# EAGLE design Atmega1280_xmem_512K_v2 (EAGLE 7.1.0)
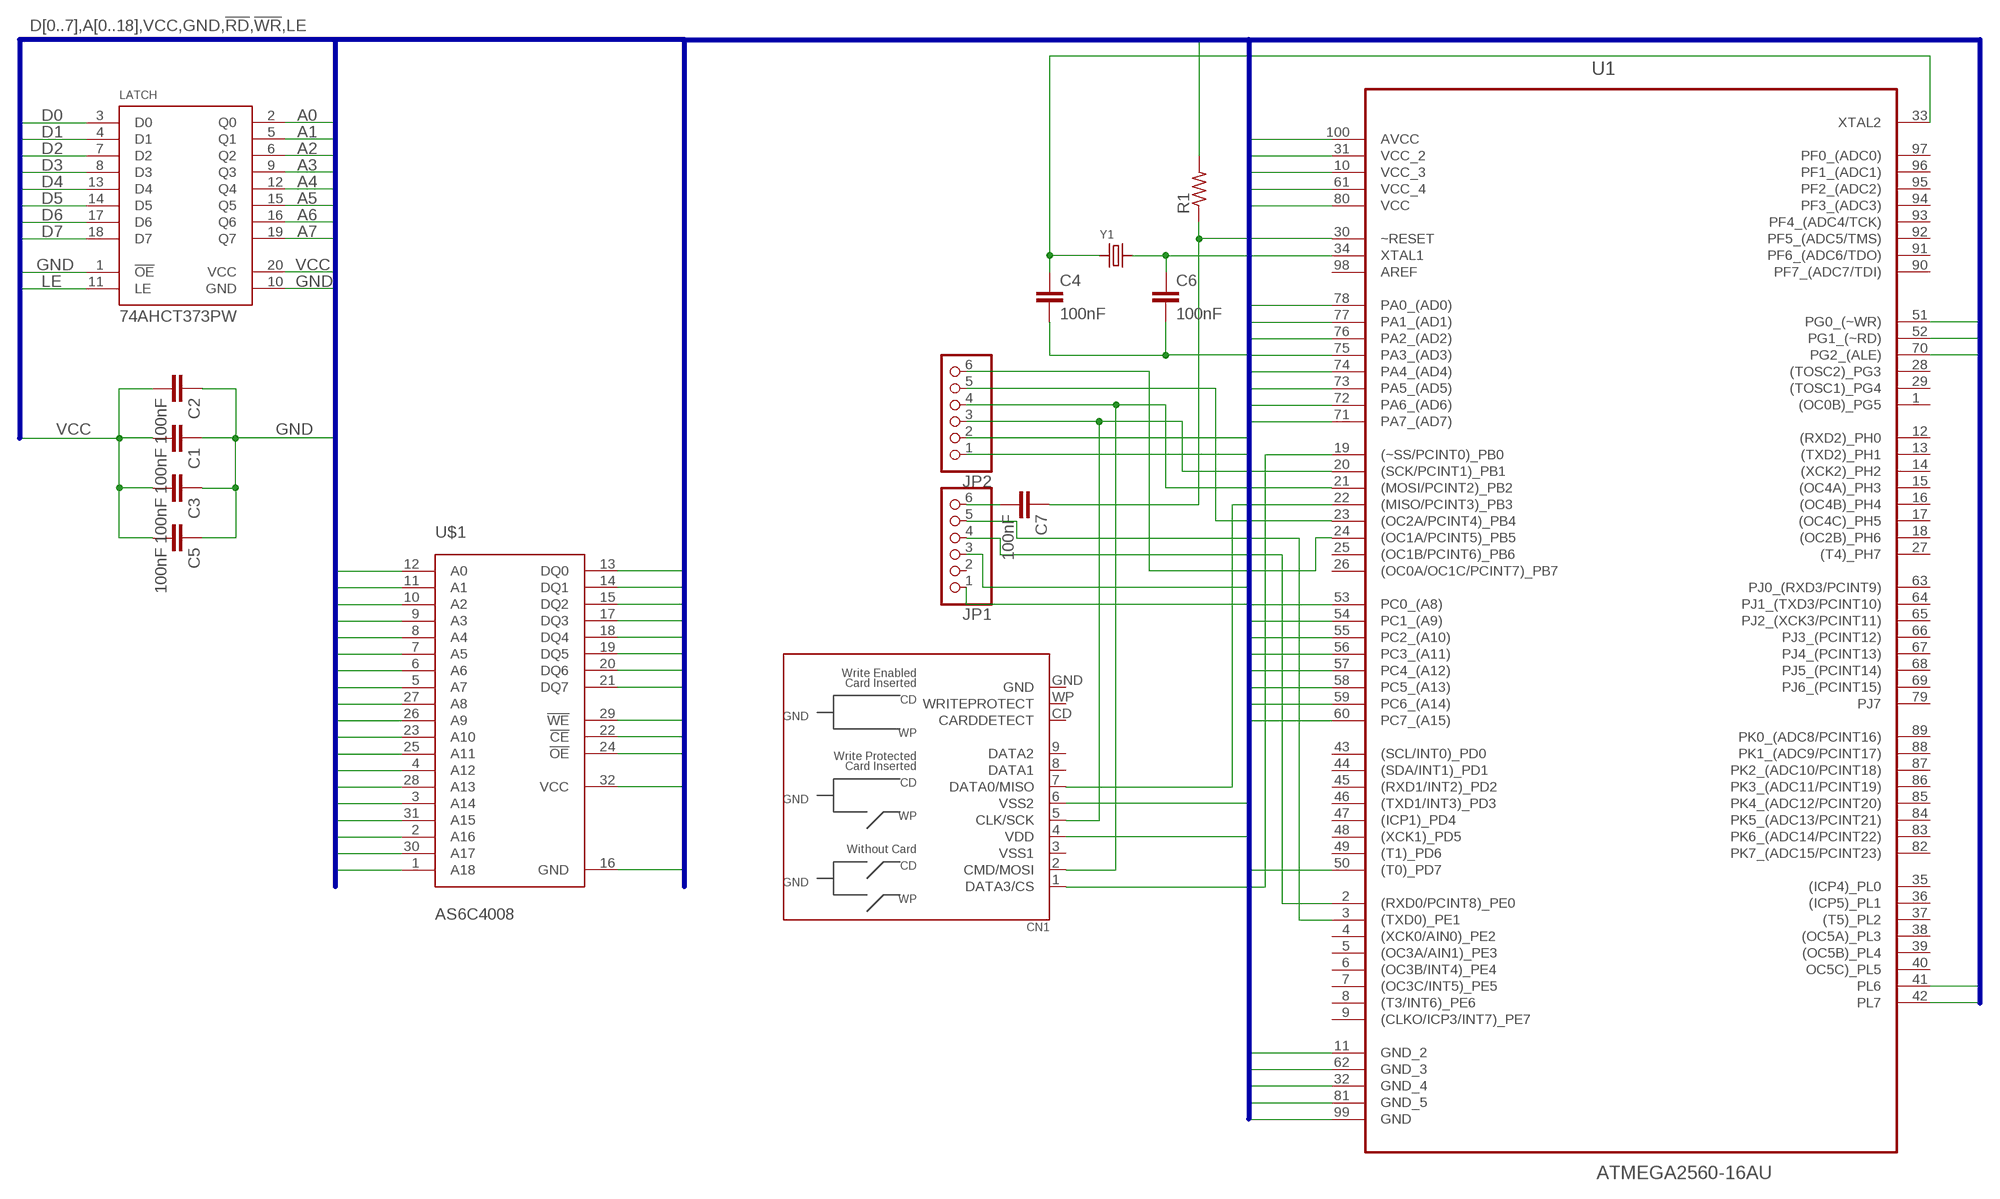
[diagram p0: schematic, sheet 1]

## Parts
C1  100nF  C-EUC0603  [C0603]
C2  100nF  C-EUC0603  [C0603]
C3  100nF  C-EUC0603  [C0603]
C4  100nF  C-EUC0603  [C0603]
C5  100nF  C-EUC0603  [C0603]
C6  100nF  C-EUC0603  [C0603]
C7  100nF  C-EUC0603  [C0603]
CN1  SDCARD  [SDCARD_SMT_4U06132]
JP1  HEADER-1X6  [1X06_OVAL]
JP2  HEADER-1X6  [1X06_OVAL]
LATCH  74AHCT373PW  [TSSOP20]
R1  R-US_R0603  [R0603]
U1  ATMEGA2560-16AU  [QFP50P1600X1600X120-100N]
U$1  AS6C4008  [SOP32]
Y1  CRYSTALSMD  [HC49UP]

## Nets
!RD: U1.52(PG1_(~RD)) U$1.24(!OE)
!WR: U1.51(PG0_(~WR)) U$1.29(!WE)
A0: LATCH.2(Q0) U$1.12(A0)
A1: LATCH.5(Q1) U$1.11(A1)
A2: LATCH.6(Q2) U$1.10(A2)
A3: LATCH.9(Q3) U$1.9(A3)
A4: LATCH.12(Q4) U$1.8(A4)
A5: LATCH.15(Q5) U$1.7(A5)
A6: LATCH.16(Q6) U$1.6(A6)
A7: LATCH.19(Q7) U$1.5(A7)
A8: U1.53(PC0_(A8)) U$1.27(A8)
A9: U1.54(PC1_(A9)) U$1.26(A9)
A10: U1.55(PC2_(A10)) U$1.23(A10)
A11: U1.56(PC3_(A11)) U$1.25(A11)
A12: U1.57(PC4_(A12)) U$1.4(A12)
A13: U1.58(PC5_(A13)) U$1.28(A13)
A14: U1.59(PC6_(A14)) U$1.3(A14)
A15: U1.60(PC7_(A15)) U$1.31(A15)
A16: U1.50((T0)_PD7) U$1.2(A16)
A17: U1.42(PL7) U$1.30(A17)
A18: U1.41(PL6) U$1.1(A18)
D0: LATCH.3(D0) U1.78(PA0_(AD0)) U$1.13(DQ0)
D1: LATCH.4(D1) U1.77(PA1_(AD1)) U$1.14(DQ1)
D2: LATCH.7(D2) U1.76(PA2_(AD2)) U$1.15(DQ2)
D3: LATCH.8(D3) U1.75(PA3_(AD3)) U$1.17(DQ3)
D4: LATCH.13(D4) U1.74(PA4_(AD4)) U$1.18(DQ4)
D5: LATCH.14(D5) U1.73(PA5_(AD5)) U$1.19(DQ5)
D6: LATCH.17(D6) U1.72(PA6_(AD6)) U$1.20(DQ6)
D7: LATCH.18(D7) U1.71(PA7_(AD7)) U$1.21(DQ7)
GND [power]: C1.1 C2.1 C3.1 C4.2 C5.1 C6.2 CN1.6(VSS2) JP1.1 JP2.1 LATCH.1(!OE) LATCH.10(GND) U1.11(GND_2) U1.32(GND_4) U1.62(GND_3) U1.81(GND_5) U1.99(GND) U$1.16(GND) U$1.22(!CE)
LE: LATCH.11(LE) U1.70(PG2_(ALE))
N$2: C6.1 U1.34(XTAL1) Y1.2
N$3: C4.1 U1.33(XTAL2) Y1.1
N$4: C7.1 R1.1 U1.30(~RESET)
N$5: C7.2 JP1.6
N$6: JP1.5 U1.3((TXD0)_PE1)
N$7: JP1.4 U1.2((RXD0/PCINT8)_PE0)
N$8: CN1.5(CLK/SCK) JP2.3 U1.20((SCK/PCINT1)_PB1)
N$9: CN1.2(CMD/MOSI) JP2.4 U1.21((MOSI/PCINT2)_PB2)
N$10: JP2.5 U1.23((OC2A/PCINT4)_PB4)
N$11: JP2.6 U1.24((OC1A/PCINT5)_PB5)
N$12: CN1.7(DATA0/MISO) U1.22((MISO/PCINT3)_PB3)
N$13: CN1.1(DATA3/CS) U1.19((~SS/PCINT0)_PB0)
VCC [power]: C1.2 C2.2 C3.2 C5.2 CN1.4(VDD) JP1.3 JP2.2 LATCH.20(VCC) R1.2 U1.10(VCC_3) U1.31(VCC_2) U1.61(VCC_4) U1.80(VCC) U1.100(AVCC) U$1.32(VCC)
Unconnected: CN1.3(VSS1) CN1.8(DATA1) CN1.9(DATA2) CN1.CD(CARDDETECT) CN1.GND CN1.WP(WRITEPROTECT) JP1.2 U1.1((OC0B)_PG5) U1.4((XCK0/AIN0)_PE2) U1.5((OC3A/AIN1)_PE3) U1.6((OC3B/INT4)_PE4) U1.7((OC3C/INT5)_PE5) U1.8((T3/INT6)_PE6) U1.9((CLKO/ICP3/INT7)_PE7) U1.12((RXD2)_PH0) U1.13((TXD2)_PH1) U1.14((XCK2)_PH2) U1.15((OC4A)_PH3) U1.16((OC4B)_PH4) U1.17((OC4C)_PH5) U1.18((OC2B)_PH6) U1.25((OC1B/PCINT6)_PB6) U1.26((OC0A/OC1C/PCINT7)_PB7) U1.27((T4)_PH7) U1.28((TOSC2)_PG3) U1.29((TOSC1)_PG4) U1.35((ICP4)_PL0) U1.36((ICP5)_PL1) U1.37((T5)_PL2) U1.38((OC5A)_PL3) U1.39((OC5B)_PL4) U1.40(OC5C)_PL5) U1.43((SCL/INT0)_PD0) U1.44((SDA/INT1)_PD1) U1.45((RXD1/INT2)_PD2) U1.46((TXD1/INT3)_PD3) U1.47((ICP1)_PD4) U1.48((XCK1)_PD5) U1.49((T1)_PD6) U1.63(PJ0_(RXD3/PCINT9)) U1.64(PJ1_(TXD3/PCINT10)) U1.65(PJ2_(XCK3/PCINT11)) U1.66(PJ3_(PCINT12)) U1.67(PJ4_(PCINT13)) U1.68(PJ5_(PCINT14)) U1.69(PJ6_(PCINT15)) U1.79(PJ7) U1.82(PK7_(ADC15/PCINT23)) U1.83(PK6_(ADC14/PCINT22)) U1.84(PK5_(ADC13/PCINT21)) U1.85(PK4_(ADC12/PCINT20)) U1.86(PK3_(ADC11/PCINT19)) U1.87(PK2_(ADC10/PCINT18)) U1.88(PK1_(ADC9/PCINT17)) U1.89(PK0_(ADC8/PCINT16)) U1.90(PF7_(ADC7/TDI)) U1.91(PF6_(ADC6/TDO)) U1.92(PF5_(ADC5/TMS)) U1.93(PF4_(ADC4/TCK)) U1.94(PF3_(ADC3)) U1.95(PF2_(ADC2)) U1.96(PF1_(ADC1)) U1.97(PF0_(ADC0)) U1.98(AREF)

## Buses
D[0..7],A[0..18],VCC,GND,!RD,!WR,LE

## Library data of the parts
C1-C7 = resistor:C-EU: CAPACITOR, European symbol
CN1 = microbuilder:SDCARD: SD Card Reader 06132 = Inexpensive SMT 19646 = Push/Pull SMT
JP1 JP2 = OLED_mod:HEADER-1X6: PIN HEADER
LATCH = andy:74AHCT373PW
R1 = resistor:R-US_: RESISTOR, American symbol
U1 = Atmel_By_element14_Batch_1-00:ATMEGA2560-16AU: Microcontroller; DESCRIPTION: Microcontroller; MPN: ATMEGA2560-16AU; OC_FARNELL: 1288330; OC_NEWARK: 23M5051; PACKAGE: LQFP-100; SUPPLIER: ATMEL
U$1 = test:AS6C4008: IC SRAM 4MBIT (512K x 8) 32SOP
Y1 = OLED_mod:CRYSTAL: Crystals HC49UP - Surface Mount Crystal 4.0MHz 18pF +/-30ppm Surface Mount Crystal [Digikey: 535-9857-1-ND] 12.0 MHz Surface Mount Crystal [Digikey: 535-9869-6-ND] 25.0 MHz Surface Mount Crystal [Digikey: 535-9078-1-ND] 2.5 x 2.0mm - MEMs SMT Crystal 16.0 MHz 10pF 20ppm 2.5 x 2.0mm Crystal [Digikey -40-85°C: 535-10923-1-ND] 3.2 x 2.5mm - MEMs SMT Crystal 12.0 MHz 8pF 15ppm 3.2 x 2.5mm Crystal [Digikey: -10-70°C: 644-1047-1-ND -40-125°C: 644-1128-1-ND] 16.0 MHz 8pF 15ppm 3.2 x 2.5mm Crystal [Digikey: -10-70°C: 644-1049-1-ND -40-125°C: 644-1129-2-ND] 16.0 MHz 10pF 10ppm 3.2 x 2.5mm Crystal [Digikey: 644-1100-1-ND] 27.12 MHz 18pF 30ppm 3.2 x 2.5mm Crystal [Digikey: 887-1424-1-ND] 27.12MHz 10pF 10ppm 3.2 x 2.5mm Crystal [Digikey: 887-1329-1-ND] 4.9 x 1.8mm - MEMs SMT Crystal 32.768 KHz 12.5pF 20ppm 4.9 x 1.8mm Crystal [Digikey: SE2415CT-ND] 8.0 x 3.8mm - Surface Mount Crystal 32.768kHz 12.5pF 20ppm -40°C-85°C [Digikey: 535-9166-2-ND] Cylinder 32.768KHz Cylinder Crystal (2x6mm body) [Ex. Digikey: 300-8341-2-ND]

## Net classes
0 default: width 0.254 mm
1 power: width 0.406 mm

## Board
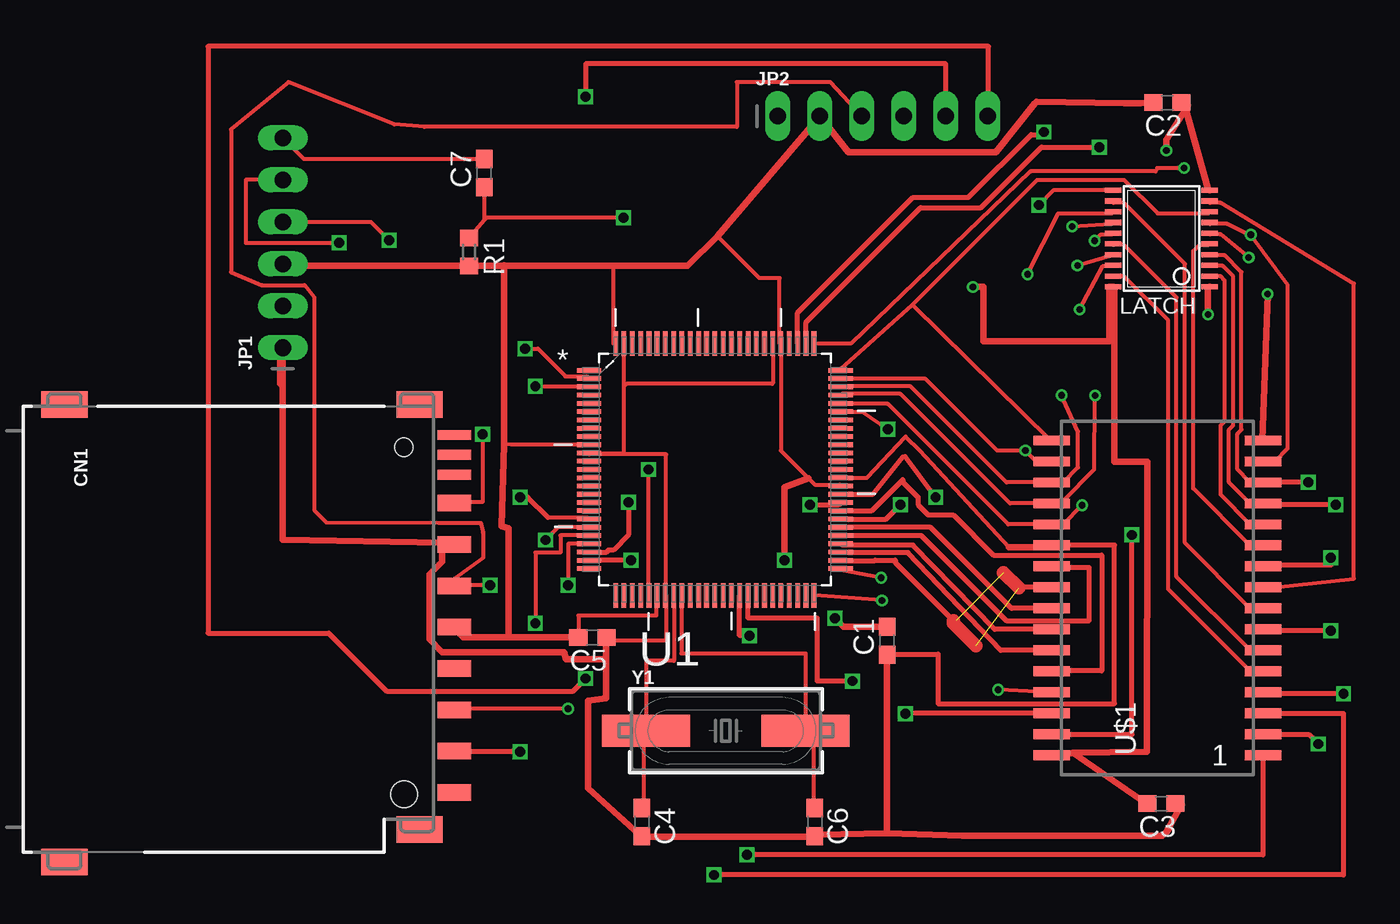
[diagram p1: board, top side]
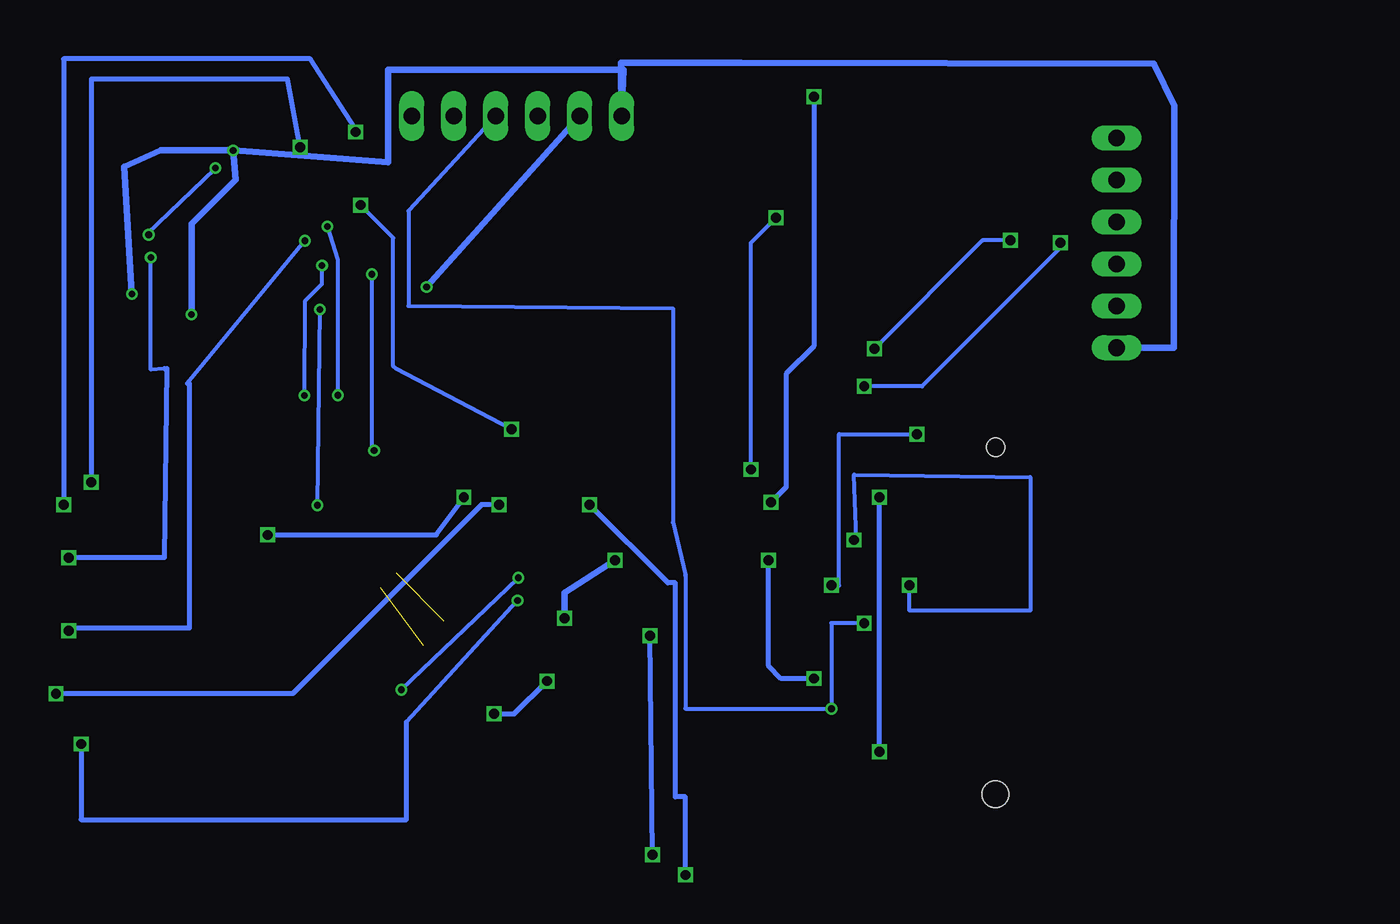
[diagram p2: board, bottom side, seen from below]

No outline drawn. Coordinates in mm, seen from the top.
Copper layers (1*16): Top 0.035mm / dielectric 1.5mm / Bottom 0.035mm
Design rules "ITead_rule *": minimum track width 9mil, minimum drill 16mil, track to track 10mil, track to pad 10mil, pad to pad 6mil, via to via 6mil, smd to smd 0mil, copper to edge 12mil, drill to drill 12mil, minimum pad ring 10mil, minimum via ring 6mil, stop-mask expansion 2mil, vias tented up to drill 100mil, thermal gap 10mil
vRestrict: area 87.3,-4.4 to 99.1,17.2; area -6.9,7.9 to 7.5,21.9; area 68.1,45.1 to 72.5,51.7

### Footprints (pad centres in the part's own frame; a part is rotated, then mirrored left to right if it is on the bottom)
C0603 = smd 1.1 x 1: 1 -0.85,0; 2 0.85,0
SDCARD_SMT_4U06132 = smd 1 x 2.008: 1 6.88,11.254; 2 4.38,11.254; 3 1.88,11.254; 4 -0.62,11.254; 5 -3.12,11.254; 6 -5.62,11.254; 7 -8.12,11.254; 9 9.38,11.254 | smd 0.6 x 2.008: 8 -9.845,11.254; CD -11.045,11.254; WP -12.245,11.254 | smd 1.6 x 2.8: GND -14.1,-12.35; NC1 -14.1,9.15; NC2 11.631,9.15; NC3 13.6,-12.35 | hole 1.6: 9.5,8.2 | hole 1.1: -11.5,8.2
1X06_OVAL = drill 1 long: 1 -6.35,0; 2 -3.81,0; 3 -1.27,0; 4 1.27,0; 5 3.81,0; 6 6.35,0
TSSOP20 = smd 0.305 x 0.991: 1 -2.925,-2.918; 2 -2.275,-2.918; 3 -1.625,-2.918; 4 -0.975,-2.918; 5 -0.325,-2.918; 6 0.325,-2.918; 7 0.975,-2.918; 8 1.625,-2.918; 9 2.275,-2.918; 10 2.925,-2.918; 11 2.925,2.918; 12 2.275,2.918; 13 1.625,2.918; 14 0.975,2.918; 15 0.325,2.918; 16 -0.325,2.918; 17 -0.975,2.918; 18 -1.625,2.918; 19 -2.275,2.918; 20 -2.925,2.918
R0603 = smd 1 x 1.1: 1 -0.85,0; 2 0.85,0
QFP50P1600X1600X120-100N = smd 1.473 x 0.279: 1 -7.62,5.994; 2 -7.62,5.512; 3 -7.62,5.004; 4 -7.62,4.496; 5 -7.62,3.988; 6 -7.62,3.505; 7 -7.62,2.997; 8 -7.62,2.489; 9 -7.62,2.007; 10 -7.62,1.499; 11 -7.62,0.991; 12 -7.62,0.508; 13 -7.62,0; 14 -7.62,-0.508; 15 -7.62,-0.991; 16 -7.62,-1.499; 17 -7.62,-2.007; 18 -7.62,-2.489; 19 -7.62,-2.997; 20 -7.62,-3.505; 21 -7.62,-3.988; 22 -7.62,-4.496; 23 -7.62,-5.004; 24 -7.62,-5.512; 25 -7.62,-5.994; 51 7.62,-5.994; 52 7.62,-5.512; 53 7.62,-5.004; 54 7.62,-4.496; 55 7.62,-3.988; 56 7.62,-3.505; 57 7.62,-2.997; 58 7.62,-2.489; 59 7.62,-2.007; 60 7.62,-1.499; 61 7.62,-0.991; 62 7.62,-0.508; 63 7.62,0; 64 7.62,0.508; 65 7.62,0.991; 66 7.62,1.499; 67 7.62,2.007; 68 7.62,2.489; 69 7.62,2.997; 70 7.62,3.505; 71 7.62,3.988; 72 7.62,4.496; 73 7.62,5.004; 74 7.62,5.512; 75 7.62,5.994 | smd 0.279 x 1.473: 26 -5.994,-7.62; 27 -5.512,-7.62; 28 -5.004,-7.62; 29 -4.496,-7.62; 30 -3.988,-7.62; 31 -3.505,-7.62; 32 -2.997,-7.62; 33 -2.489,-7.62; 34 -2.007,-7.62; 35 -1.499,-7.62; 36 -0.991,-7.62; 37 -0.508,-7.62; 38 0,-7.62; 39 0.508,-7.62; 40 0.991,-7.62; 41 1.499,-7.62; 42 2.007,-7.62; 43 2.489,-7.62; 44 2.997,-7.62; 45 3.505,-7.62; 46 3.988,-7.62; 47 4.496,-7.62; 48 5.004,-7.62; 49 5.512,-7.62; 50 5.994,-7.62; 76 5.994,7.62; 77 5.512,7.62; 78 5.004,7.62; 79 4.496,7.62; 80 3.988,7.62; 81 3.505,7.62; 82 2.997,7.62; 83 2.489,7.62; 84 2.007,7.62; 85 1.499,7.62; 86 0.991,7.62; 87 0.508,7.62; 88 0,7.62; 89 -0.508,7.62; 90 -0.991,7.62; 91 -1.499,7.62; 92 -2.007,7.62; 93 -2.489,7.62; 94 -2.997,7.62; 95 -3.505,7.62; 96 -3.988,7.62; 97 -4.496,7.62; 98 -5.004,7.62; 99 -5.512,7.62; 100 -5.994,7.62
SOP32 = smd 0.6 x 2.2: 1 -9.525,-6.4; 2 -8.255,-6.4; 3 -6.985,-6.4; 4 -5.715,-6.4; 5 -4.445,-6.4; 6 -3.175,-6.4; 7 -1.905,-6.4; 8 -0.635,-6.4; 9 0.635,-6.4; 10 1.905,-6.4; 11 3.175,-6.4; 12 4.445,-6.4; 13 5.715,-6.4; 14 6.985,-6.4; 15 8.255,-6.4; 16 9.525,-6.4; 17 9.525,6.4; 18 8.255,6.4; 19 6.985,6.4; 20 5.715,6.4; 21 4.445,6.4; 22 3.175,6.4; 23 1.905,6.4; 24 0.635,6.4; 25 -0.635,6.4; 26 -1.905,6.4; 27 -3.175,6.4; 28 -4.445,6.4; 29 -5.715,6.4; 30 -6.985,6.4; 31 -8.255,6.4; 32 -9.525,6.4
HC49UP = smd 5.334 x 1.93: 1 -4.826,0; 2 4.826,0

### Placement (x,y rotation side)
C1  53.59,23.93 90 top
C2  70.56,56.49 180 top
C3  70.21,14.07 180 top
C4  38.76,12.95 270 top
C5  35.76,24.13 180 top
C6  49.23,12.95 270 top
C7  29.21,52.22 90 top
CN1  16.15,24.13 270 top
JP1  17.02,48.01 90 top
JP2  53.34,55.68 0 top
LATCH  70.21,48.26 90 top
R1  28.3,47.45 270 top
U1  43.18,34.29 0 top
U$1  69.95,26.52 90 top
Y1  43.84,18.49 0 top

### Tracks (layer width: path | path; a pad name or v marks a point on that pad's centre or on a via)
!RD  (2 unrouted)
  Top 0.305: U1.52 52.86,28.78 52.88,28.8 54.1,28.8 54.1,28.65 57.61,25.15 | U$1.24 61.57,27.15 61.57,27.13
  Top 0.813: 61.57,27.13 60.66,28.04 | 57.61,25.15 57.61,24.99 58.98,23.62
!WR  (via drill 0.41)
  Top 0.254: v53.24,27.74 50.8,28.19 U1.51 | v60.33,20.95 62.74,20.83 63.5,20.83 U$1.29
  Bottom 0.254: v60.33,20.95 v53.24,27.74
A0
  Top 0.254: LATCH.2 73.15,45.97 73.79,45.97 74.04,45.72 74.04,37.21 73.79,36.96 73.79,32.77 75.56,30.99 76.33,30.99 U$1.12
A1
  Top 0.254: LATCH.5 73.03,47.88 72.52,47.88 72.14,47.5 72.14,33.15 75.56,29.72 76.33,29.72 U$1.11
A2  (via drill 0.41, 0.6)
  Top 0.254: v75.49,47.12 73.79,48.51 73.15,48.51 LATCH.6
  Top 0.305: v80.47,28.96 80.47,28.5 76.35,28.5 U$1.10
  Bottom 0.254: v75.49,47.12 75.49,40.34 74.68,40.39
  Bottom 0.305: 74.68,40.39 74.52,40.39 74.68,28.96 v80.47,28.96
A3
  Top 0.254: LATCH.9 73.15,50.42 73.79,50.42 81.86,45.54 81.86,27.69 77.09,27.18 76.45,27.18 U$1.9
A4
  Top 0.254: LATCH.12 67.31,50.42 67.94,50.42 71.63,46.74 71.63,29.84 75.56,25.91 76.33,25.91 U$1.8
A5  (via drill 0.41, 0.6)
  Top 0.254: v66.17,48.13 66.55,48.51 67.18,48.51 LATCH.15
  Top 0.305: v80.47,24.54 76.35,24.54 U$1.7
  Bottom 0.254: 73.28,39.5 v66.17,48.13
  Bottom 0.305: 73.28,39.5 73.15,39.5 73.15,24.69 80.47,24.69 v80.47,24.54
A6
  Top 0.254: LATCH.16 67.31,47.88 67.94,47.88 71.12,44.7 71.12,27.81 75.56,23.37 76.33,23.37 U$1.6
A7
  Top 0.254: LATCH.19 67.31,45.97 67.94,45.97 70.61,43.31 70.61,27.05 75.56,22.1 76.33,22.1 U$1.5
A8
  Top 0.305: U$1.27 60.48,23.34 54.86,29.26 50.83,29.26 U1.53
A9
  Top 0.305: U$1.26 60.12,24.61 55.17,29.72 50.88,29.72 U1.54
A10
  Top 0.305: U1.55 55.65,30.3 60.81,25.15 65.84,25.15 65.84,28.35 63.55,28.35 U$1.23
A11
  Top 0.305: U$1.25 61.14,25.88 56.24,30.79 U1.56
A12  (via drill 0.6)
  Top 0.305: U1.57 53.54,31.29 v54.41,32.16 | v81.23,20.73 76.43,20.73 U$1.4
  Bottom 0.305: v54.41,32.16 55.47,32.16 66.9,20.73 v81.23,20.73
A13
  Top 0.305: U1.58 52.68,31.8 54.56,33.68 54.56,33.53 55.47,32.61 55.47,32.16 56.08,31.55 57.61,31.55 60.05,29.11 66.6,29.11 66.6,22.1 63.55,22.1 U$1.28
A14  (via drill 0.6)
  Top 0.305: U$1.3 81.23,19.53 81.23,9.75 v43.13,9.75 | v48.92,32.16 50.67,32.16 U1.59
  Bottom 0.305: v43.13,9.75 43.13,14.48 43.74,14.48 43.74,27.43 44.2,27.43 v48.92,32.16
A15  (via drill 0.6)
  Top 0.305: U1.60 52.76,32.79 54.56,35.05 54.69,35.08 v56.54,32.61 | U$1.31 68.43,18.26 v68.43,30.33
  Bottom 0.305: v68.43,30.33 58.22,30.33 v56.54,32.61
A16  (via drill 0.41, 0.6)
  Top 0.254: v53.29,26.36 U1.50
  Top 0.305: U$1.2 79.12,18.26 v79.7,17.68
  Bottom 0.254: 60.02,19.02 v53.29,26.36
  Bottom 0.305: v79.7,17.68 79.7,13.11 60.02,13.11 60.02,19.02
A17  (via drill 0.6)
  Top 0.305: U$1.30 54.74,19.53 v54.71,19.51 | v51.51,21.49 49.38,21.49 49.38,25.3 45.19,25.3 U1.42
  Bottom 0.305: v54.71,19.51 53.49,19.51 v51.51,21.49
A18  (via drill 0.6)
  Top 0.305: U$1.1 | U$1.1 76.35,10.97 v45.11,10.97 | v45.26,24.23 44.68,24.23 U1.41
  Bottom 0.305: v45.11,10.97 v45.26,24.23
D0  (via drill 0.6)
  Top 0.254: LATCH.3 73.15,46.61 73.91,46.61 74.55,45.97 74.55,36.96 74.3,36.7 74.3,33.53 75.56,32.26 76.33,32.26 U$1.13
  Top 0.305: U1.78 48.18,43.76 55.17,50.75 58.52,50.75 62.33,54.56 62.94,54.56 v63.09,54.71 | v80.77,32.16 76.35,32.16 U$1.13
  Bottom 0.305: v63.09,54.71 63.09,54.86 65.84,59.13 80.77,59.13 v80.77,32.16
D1  (via drill 0.6)
  Top 0.254: LATCH.4 73.15,47.24 74.04,47.24 75.06,46.23 75.06,36.7 74.8,36.45 74.8,34.29 75.56,33.53 76.33,33.53 U$1.14
  Top 0.305: U1.77 48.69,43.2 55.63,50.14 59.28,50.14 62.94,53.8 v66.45,53.8 | v79.1,33.53 76.35,33.53 U$1.14
  Bottom 0.305: v66.45,53.8 67.21,57.91 79.1,57.91 v79.1,33.53
D2  (via drill 0.41)
  Top 0.254: 75.68,48.4 77.85,45.47 77.85,35.56 77.09,34.8 76.45,34.8 U$1.15 | 75.68,48.4 74.17,49.15 73.15,49.15 LATCH.7 | U1.76 51.41,41.91 62.28,52.32 69.85,52.32 69.95,52.53 v71.58,52.53 | v75.62,48.49 75.68,48.4
  Bottom 0.254: v71.58,52.53 75.74,48.51 75.56,48.51 75.62,48.46 v75.62,48.49
D3
  Top 0.254: 55.14,44.27 50.8,40.39 U1.75 | 55.14,44.27 62.69,51.82 67.94,51.82 69.98,49.78 73.03,49.78 LATCH.8 | 55.14,44.27 63.5,36.07 U$1.17
D4  (via drill 0.41)
  Top 0.254: v62.1,46.1 63.96,49.78 67.18,49.78 LATCH.13 | U$1.18 63.5,34.8 62.61,34.8 v61.98,35.43 60.27,35.43 55.93,39.78 50.83,39.78 U1.74
  Bottom 0.254: v62.1,46.1 62.1,35.56 v61.98,35.43
D5  (via drill 0.41)
  Top 0.254: v64.8,49 67.18,49.15 LATCH.14 | v64.16,38.79 65.15,36.58 65.15,34.42 64.26,33.53 63.63,33.53 U$1.19 60.83,33.5 55.02,39.32 50.83,39.32 U1.73
  Bottom 0.254: v64.8,49 64.16,46.99 v64.16,38.79
D6  (via drill 0.41)
  Top 0.254: v65.13,46.63 67.18,47.24 LATCH.17 | v66.19,38.76 66.14,34.29 64.26,32.41 64.26,32.26 63.63,32.26 U$1.20 61.04,32.23 54.41,38.86 50.88,38.86 U1.72
  Bottom 0.254: v66.19,38.76 66.14,44.5 65.13,45.52 v65.13,46.63
D7  (via drill 0.41)
  Top 0.254: v65.25,43.97 66.67,46.61 67.18,46.61 LATCH.18 | v65.41,32.13 64.26,30.99 63.63,30.99 U$1.21 60.94,30.96 53.65,38.25 50.83,38.25 U1.71
  Bottom 0.254: v65.41,32.13 v65.25,43.97
GND  (via drill 0.41)
  Top 0.254: 40.23,26.67 40.23,23.93 36.61,23.93 C5.1 | U1.32 40.23,26.67 | 40.23,26.67 40.23,35.2 35.56,35.2 U1.11 37.67,35.28 37.67,39.32 | 37.67,39.32 U1.99 | U1.81 46.69,39.52 46.63,39.47 37.82,39.47 37.67,39.32 | U1.62 52.38,33.78 54.71,36.27 55.55,35.46 60.96,29.59
  Top 0.305: 53.72,23.11 56.69,23.11 56.69,20.12 67.36,20.12 67.36,29.72 63.55,29.72 U$1.22
  Top 0.406: v73.03,43.66 73.03,45.21 LATCH.1 | v70.51,53.59 70.51,54.23 71.81,56.29 C2.1 71.65,56.19 73.03,51.31 LATCH.10 | v76.63,44.91 76.33,36.07 U$1.16 | JP1.1 17.02,30.02 26.8,29.84 27.3,29.84 CN1.6 26.67,29.72 26.67,28.7 25.91,27.94 25.91,24 26.67,23.24 34.04,23.24 34.16,22.81 36.58,22.81 | 53.59,12.27 49.4,12.19 C6.2 49.15,12.06 38.86,12.06 C4.2 38.61,12.19 35.51,14.99 35.51,20.3 36.58,20.45 36.58,22.81 | 36.58,22.81 36.58,24.13 C5.1 | 53.59,12.27 58.17,12.12 70.26,12.12 70.64,12.5 70.48,12.32 71.45,14.05 C3.1 | 60.96,29.59 63.5,29.59 U$1.22 | 53.72,23.11 C1.1 53.59,12.27 | 16.87,41.5 16.87,39.47
  Bottom 0.406: v73.03,43.66 73.03,49.15 70.36,51.82 v70.51,53.59 | v76.63,44.91 77.09,52.6 74.88,53.59 v70.51,53.59 | v70.51,53.59 61.11,52.88 61.11,58.47 46.89,58.47 JP2.1 47.02,58.9 39.78,58.9 14.78,58.83 13.54,56.31 13.56,42.52 13.56,41.66 JP1.1
LE  (via drill 0.6)
  Top 0.254: U1.70 52.12,37.8 v53.65,36.73 | v62.79,50.29 63.7,51.21 67.27,51.21 LATCH.11
  Bottom 0.254: v53.65,36.73 60.66,40.39 60.81,40.54 60.81,48.31 v62.79,50.29
N$2
  Top 0.254: C6.1 49.15,13.84 49.15,18.03 48.77,18.41 Y1.2 48.67,23.16 41.15,23.16 41.15,26.67 U1.34
N$3
  Top 0.254: C4.1 38.86,13.84 38.86,18.29 38.99,18.41 Y1.1 39.01,22.71 40.69,22.71 U1.33
N$4  (via drill 0.6)
  Top 0.254: C7.1 29.21,49.38 | 29.21,49.38 R1.1 | U1.30 39.17,26.67 v39.17,34.29 | v37.64,49.53 29.36,49.53 29.21,49.38
  Bottom 0.254: v39.17,34.29 39.17,48.01 v37.64,49.53
N$5
  Top 0.254: JP1.6 18.29,53.09 29.21,53.09 C7.2
N$6  (via drill 0.6)
  Top 0.254: JP1.5 14.78,51.82 14.78,48.01 v20.42,48.01 | v32.31,39.32 35.53,39.32 U1.3
  Bottom 0.254: v20.42,48.01 20.42,47.7 28.8,39.32 v32.31,39.32
N$7  (via drill 0.6)
  Top 0.254: JP1.4 22.35,49.28 v23.47,48.16 | v31.7,41.6 32.46,41.6 34.14,39.93 35.43,39.93 U1.2
  Bottom 0.254: v23.47,48.16 25.15,48.16 v31.7,41.6
N$8  (via drill 0.6)
  Top 0.254: JP2.3 50.16,57.73 44.5,57.73 44.5,55.02 25.6,55.02 23.77,55.17 17.37,57.73 13.89,54.86 13.89,46.23 15.75,45.44 18.34,45.44 18.92,44.7 18.92,31.83 19.66,31.09 26.47,31.06 29.01,31.06 29.13,30.48 29.13,28.93 27.43,27.69 27.43,27.3 CN1.5 27.41,27.28 v29.57,27.28 | U1.20 33.68,30.79 v32.92,30.02
  Bottom 0.254: v32.92,30.02 32.77,30.02 32.92,33.98 22.25,33.83 22.25,25.76 29.57,25.76 v29.57,27.28
N$9  (via drill 0.41, 0.6)
  Top 0.254: v34.29,19.81 27.43,19.81 CN1.2 | U1.21 33.83,30.3 33.83,29.26 32.31,29.26 v32.31,24.99
  Bottom 0.254: JP2.4 59.89,49.94 59.89,44.2 43.89,44.04 43.89,31.09 43.13,27.89 43.13,19.81 v34.29,19.81 34.29,24.99 v32.31,24.99
N$10  (via drill 0.6)
  Top 0.305: JP2.5 57.15,58.83 35.36,58.83 v35.36,56.84 | v37.95,32.31 37.95,30.33 37.03,29.41 36.73,29.41 36.58,29.26 35.59,29.26 U1.23
  Bottom 0.305: v35.36,56.84 35.36,41.76 37.03,40.08 37.03,33.22 v37.95,32.31
N$11  (via drill 0.6)
  Top 0.305: JP2.6 59.74,55.68 59.74,59.89 12.5,59.89 12.5,24.38 19.81,24.38 23.32,20.88 34.59,20.88 v35.36,21.64 | v38.1,28.8 35.59,28.8 U1.24
  Bottom 0.305: v35.36,21.64 37.34,21.64 38.1,22.4 v38.1,28.8
N$12  (via drill 0.6)
  Top 0.254: U1.22 34.29,29.79 v34.29,27.28 | v29.11,36.42 29.11,32.31 27.41,32.31 CN1.7
  Bottom 0.254: v34.29,27.28 33.83,27.28 33.83,36.42 v29.11,36.42
N$13  (via drill 0.6)
  Top 0.254: 33.07,31.39 35.46,31.39 U1.19
  Top 0.305: CN1.1 30.94,17.25 v31.39,17.22 | v31.39,32.61 31.85,32.61 33.07,31.39
  Bottom 0.305: v31.39,17.22 v31.39,32.61
VCC  (via drill 0.41, 0.6)
  Top 0.254: U1.31 39.62,26.67 39.62,25.45 34.91,25.45 C5.2 | U1.10 30.86,35.79 30.4,35.81 | U1.100 37.03,41.91 37.03,46.61 | 43.33,48.41 45.87,45.87 47.09,45.87 47.09,41.91 U1.80 47.17,35.43 48.84,33.76 49.23,33.38 50.72,33.38 U1.61
  Top 0.406: 64.83,17.16 64.39,17.02 63.63,17.02 U$1.32 | 64.83,17.16 69.32,17.22 69.34,33.38 69.34,34.75 67.36,34.75 67.36,45.21 67.18,45.21 LATCH.20 67.06,45.34 67.06,42.06 59.44,42.06 59.44,45.34 v58.8,45.34 | 64.83,17.16 69.34,14.02 C3.2 | C2.2 68.94,56.44 67.97,56.44 62.64,56.54 62.53,56.44 60.2,53.49 51.26,53.49 JP2.2 43.33,48.41 41.53,46.61 37.03,46.61 29.46,46.61 R1.2 | JP1.3 17.14,46.61 29.21,46.61 R1.2 | 30.68,24.13 27.94,24.13 27.43,24.64 CN1.4 | 30.68,24.13 C5.2 | 30.68,24.13 30.68,30.73 30.25,30.86 30.4,35.81 30.4,46.63 R1.2 | C1.2 50.97,24.78 v50.44,25.3 | v47.4,28.8 47.4,33.22 48.84,33.76
  Bottom 0.406: JP2.2 v58.8,45.34 | v50.44,25.3 50.44,26.82 v47.4,28.8